# EAGLE design HHV_SCA_Demo-P1 (EAGLE 6.5.0)
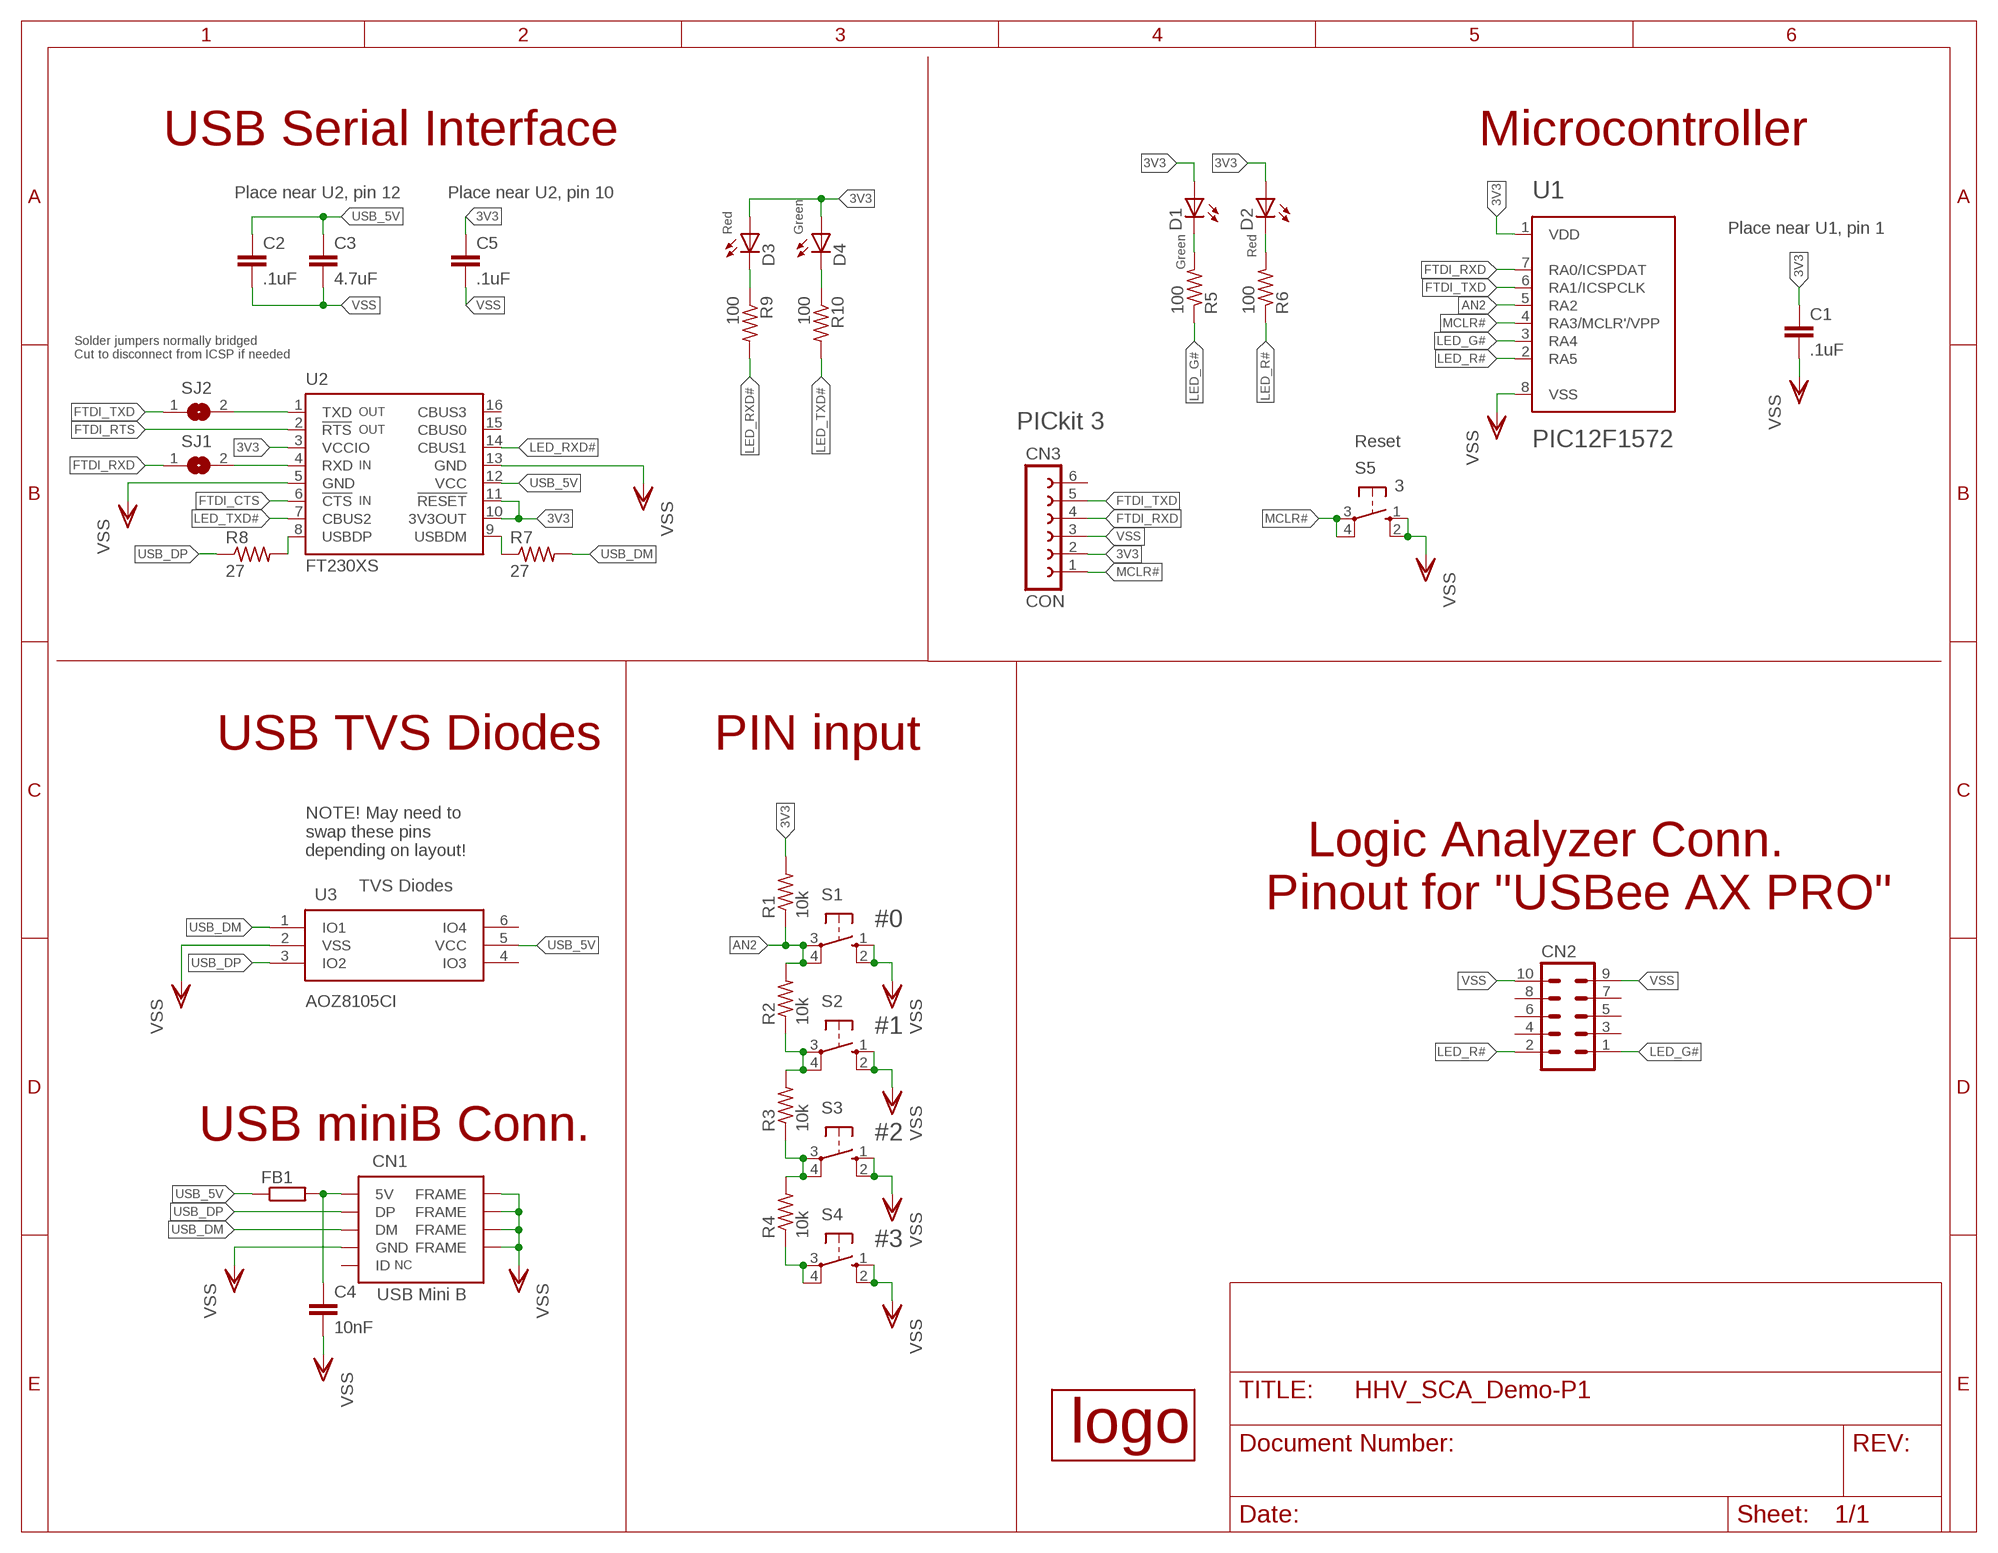
[diagram p0: schematic, sheet 1]
FRAME1 (FRAME_A_L): REV: P1

## Parts
C1  .1uF  C-EUC0603K  [C0603K]
C2  .1uF  C-EUC0603K  [C0603K]
C3  4.7uF  C-EUC0603K  [C0603K]
C4  10nF  C-EUC0603K  [C0603K]
C5  .1uF  C-EUC0603K  [C0603K]
CN1  MINIUSB-SMD  [MINIUSB-SMD]
CN2  MA05-2  [MA05-2]
CN3  CON  FE06-1  [FE06]
D1  LED3MM  [LED3MM]
D2  LED3MM  [LED3MM]
D3  LED3MM  [LED3MM]
D4  LED3MM  [LED3MM]
FB1  R-EU_R0603  [R0603]
R1  10k  R-US_R0603  [R0603]
R2  10k  R-US_R0603  [R0603]
R3  10k  R-US_R0603  [R0603]
R4  10k  R-US_R0603  [R0603]
R5  100  R-US_R0603  [R0603]
R6  100  R-US_R0603  [R0603]
R7  27  R-US_R0402  [R0402]
R8  27  R-US_R0402  [R0402]
R9  100  R-US_R0603  [R0603]
R10  100  R-US_R0603  [R0603]
S1  10-XX  [B3F-10XX]
S2  10-XX  [B3F-10XX]
S3  10-XX  [B3F-10XX]
S4  10-XX  [B3F-10XX]
S5  3  10-XX  [B3F-10XX]
SJ1  SJ  [SJ]
SJ2  SJ  [SJ]
U1  PIC12F1572  PIC12F1571  [DIL8]
U2  FT230XS  [SSOP16]
U3  AOZ8105CI  [SOT23-6L]
U$1  KBELOGO-SILK  [KBELOGO-SILK]

## Nets
3V3: C1.1 C5.1 CN3.2 D1.A D2.A D3.A D4.A R1.2 U1.1(VDD) U2.3(VCCIO) U2.10(3V3OUT) U2.11(!RESET)
AN2: R1.1 R2.2 S1.3(P) S1.4(P1) U1.5(RA2)
FTDI_CTS: U2.6(!CTS)
FTDI_RTS: U2.2(!RTS)
FTDI_RXD: CN3.4 SJ1.1 U1.7(RA0/ICSPDAT)
FTDI_TXD: CN3.5 SJ2.1 U1.6(RA1/ICSPCLK)
LED_G#: CN2.1 R5.1 U1.3(RA4)
LED_R#: CN2.2 R6.1 U1.2(RA5)
LED_RXD#: R9.2 U2.14(CBUS1)
LED_TXD#: R10.2 U2.7(CBUS2)
MCLR#: CN3.1 S5.3(P) S5.4(P1) U1.4(RA3/MCLR'/VPP)
N$1: R4.1 S4.3(P) S4.4(P1)
N$2: R3.1 R4.2 S3.3(P) S3.4(P1)
N$3: D2.K(C) R6.2
N$4: R7.1 U2.9(USBDM)
N$5: R2.1 R3.2 S2.3(P) S2.4(P1)
N$6: R8.2 U2.8(USBDP)
N$8: D1.K(C) R5.2
N$11: D3.K(C) R9.1
N$12: C4.1 CN1.5V FB1.2
N$13: D4.K(C) R10.1
N$14: SJ2.2 U2.1(TXD)
N$15: SJ1.2 U2.4(RXD)
USB_5V: C2.1 C3.1 FB1.1 U2.12(VCC) U3.5(VCC)
USB_DM: CN1.USB_DM(DM) R7.2 U3.1(IO1)
USB_DP: CN1.USB_DP(DP) R8.1 U3.3(IO2)
VSS: C1.2 C2.2 C3.2 C4.2 C5.2 CN1.GND@0(FRAME) CN1.GND@1(FRAME) CN1.GND@2(FRAME) CN1.GND@3(FRAME) CN1.VSS(GND) CN2.9 CN2.10 CN3.3 S1.1(S) S1.2(S1) S2.1(S) S2.2(S1) S3.1(S) S3.2(S1) S4.1(S) S4.2(S1) S5.1(S) S5.2(S1) U1.8(VSS) U2.5(GND) U2.13(GND) U3.2(VSS)
Unconnected: CN1.ID CN2.3 CN2.4 CN2.5 CN2.6 CN2.7 CN2.8 CN3.6 U2.15(CBUS0) U2.16(CBUS3) U3.4(IO3) U3.6(IO4)

## Notes on the sheet
- USB Serial Interface | Microcontroller
- Place near U2, pin 12 | Place near U2, pin 10
- Red | Green | Green | Red | Place near U1, pin 1
- Solder jumpers normally bridged
  Cut to disconnect from ICSP if needed
- OUT
- PICkit 3
- OUT
- Reset
- IN
- IN
- USB TVS Diodes | PIN input
- NOTE! May need to
  swap these pins
  depending on layout!
- TVS Diodes
- Logic Analyzer Conn.
  Pinout for "USBee AX PRO"
- #0
- #1
- USB miniB Conn. | #2
- CN1
- #3
- NC
- USB Mini B

## Library data of the parts
C1-C5 = rcl:C-EU: CAPACITOR, European symbol
CN1 = cuslibrary:MINIUSB-SMD: EDAC 690-005-299-043 CONN MINI USB RCPT RA TYPE B SMD
CN2 = con-lstb:MA05-2: PIN HEADER; OC_FARNELL: unknown; OC_NEWARK: unknown
CN3 = con-lsta:FE06-1: FEMALE HEADER; OC_FARNELL: unknown; OC_NEWARK: unknown
D1-D4 = led:LED: LED OSRAM: - CHIPLED LG R971, LG N971, LY N971, LG Q971, LY Q971, LO R971, LY R971 LH N974, LH R974 LS Q976, LO Q976, LY Q976 LO Q996 - Hyper CHIPLED LW Q18S LB Q993, LB Q99A, LB R99A - SideLED LS A670, LO A670, LY A670, LG A670, LP A670 LB A673, LV A673, LT A673, LW A673 LH A674 LY A675 LS A676, LA A676, LO A676, LY A676, LW A676 LS A679, LY A679, LG A679 - Hyper Micro SIDELED® LS Y876, LA Y876, LO Y876, LY Y876 LT Y87S - SmartLED LW L88C, LW L88S LB L89C, LB L89S, LG L890 LS L89K, LO L89K, LY L89K LS L896, LA L896, LO L896, LY L896 - TOPLED LS T670, LO T670, LY T670, LG T670, LP T670 LSG T670, LSP T670, LSY T670, LOP T670, LYG T670 LG T671, LOG T671, LSG T671 LB T673, LV T673, LT T673, LW T673 LH T674 LS T676, LA T676, LO T676, LY T676, LB T676, LH T676, LSB T676, LW T676 LB T67C, LV T67C, LT T67C, LS T67K, LO T67K, LY T67K, LW E67C LS E67B, LA E67B, LO E67B, LY E67B, LB E67C, LV E67C, LT E67C LW T67C LS T679, LY T679, LG T679 LS T770, LO T770, LY T770, LG T770, LP T770 LB T773, LV T773, LT T773, LW T773 LH T774 LS E675, LA E675, LY E675, LS T675 LS T776, LA T776, LO T776, LY T776, LB T776 LHGB T686 LT T68C, LB T68C - Hyper Mini TOPLED® LB M676 - Mini TOPLED Santana® LG M470 LS M47K, LO M47K, LY M47K Source: http://www.osram.convergy.de LUXEON: - LUMILED® LXK2-PW12-R00, LXK2-PW12-S00, LXK2-PW14-U00, LXK2-PW14-V00 LXK2-PM12-R00, LXK2-PM12-S00, LXK2-PM14-U00 LXK2-PE12-Q00, LXK2-PE12-R00, LXK2-PE12-S00, LXK2-PE14-T00, LXK2-PE14-U00 LXK2-PB12-K00, LXK2-PB12-L00, LXK2-PB12-M00, LXK2-PB14-N00, LXK2-PB14-P00, LXK2-PB14-Q00 LXK2-PR12-L00, LXK2-PR12-M00, LXK2-PR14-Q00, LXK2-PR14-R00 LXK2-PD12-Q00, LXK2-PD12-R00, LXK2-PD12-S00 LXK2-PH12-R00, LXK2-PH12-S00 LXK2-PL12-P00, LXK2-PL12-Q00, LXK2-PL12-R00 Source: www.luxeon.com KINGBRIGHT: KA-3528ASYC Source: www.kingbright.com
FB1 = rcl:R-EU_: RESISTOR, European symbol
R1-R10 = rcl:R-US_: RESISTOR, American symbol
S1-S5 = switch-omron:10-XX: OMRON SWITCH; MPN: B3F-1000; OC_FARNELL: 176432; OC_NEWARK: 36M3542
SJ1 SJ2 = jumper:SJ: SMD solder JUMPER
U1 = cuslibrary:PIC12F1571: PIC12F1571/2
U2 = ftdichip:FT230X: USB to BASIC UART IC Auto generated by make-symbol-device-package-bsdl.ulp Rev. 43 Source: Data sheet <http://www.ftdichip.com/Support/Documents/DataSheets/ICs/DS_FT230X.pdf>
U3 = cuslibrary:AOZ8105CI
U$1 = cuslibrary:KBELOGO-SILK

## Board
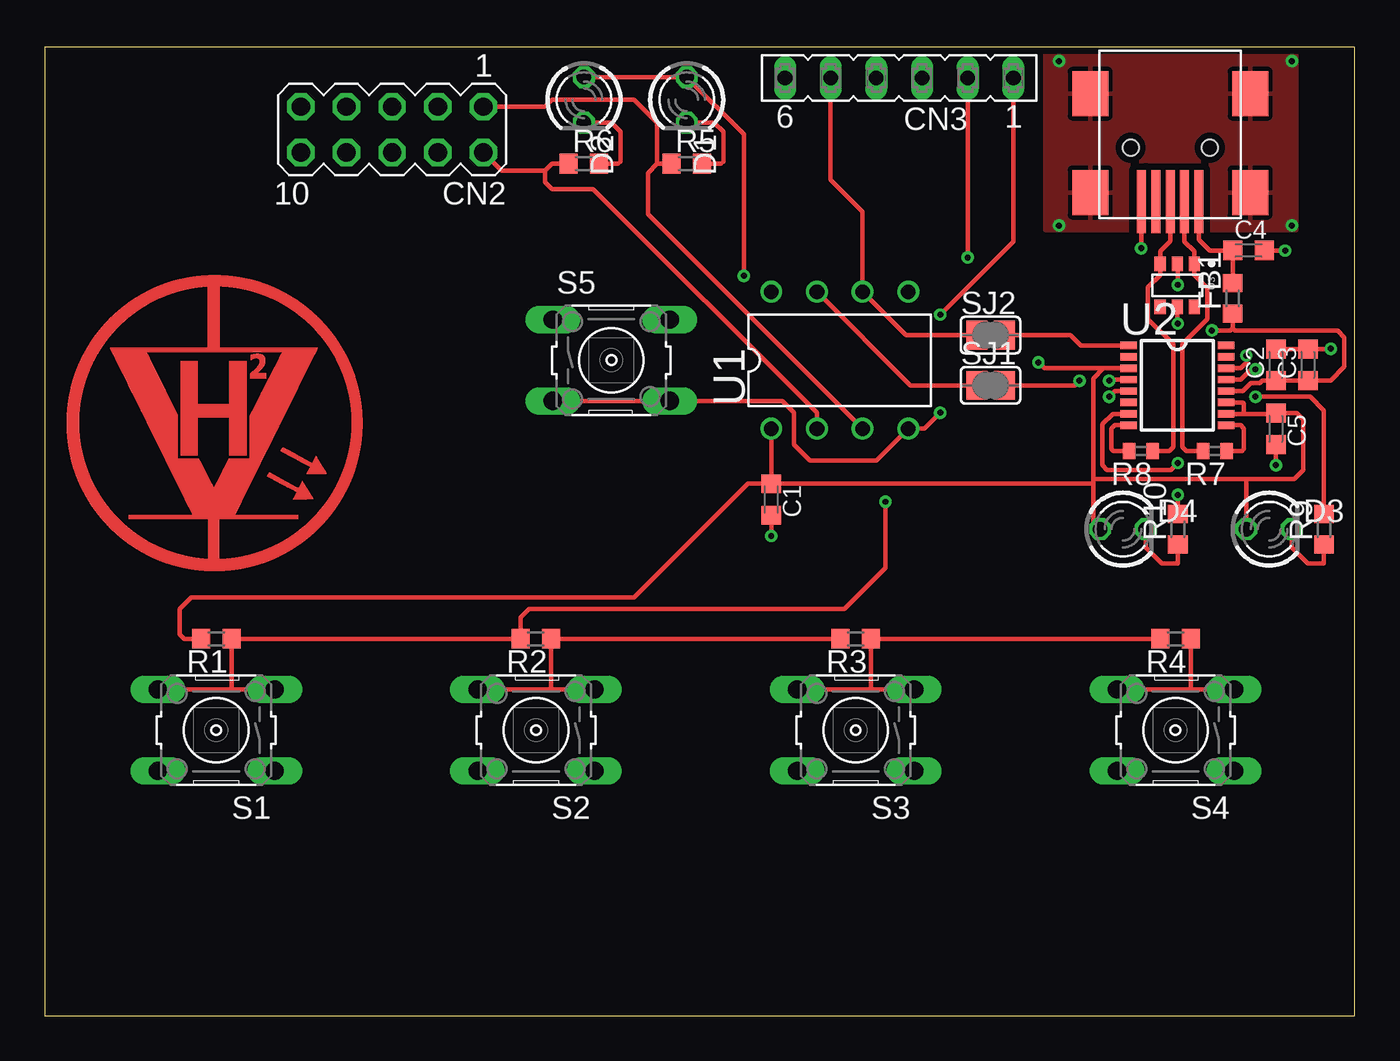
[diagram p1: board, top side]
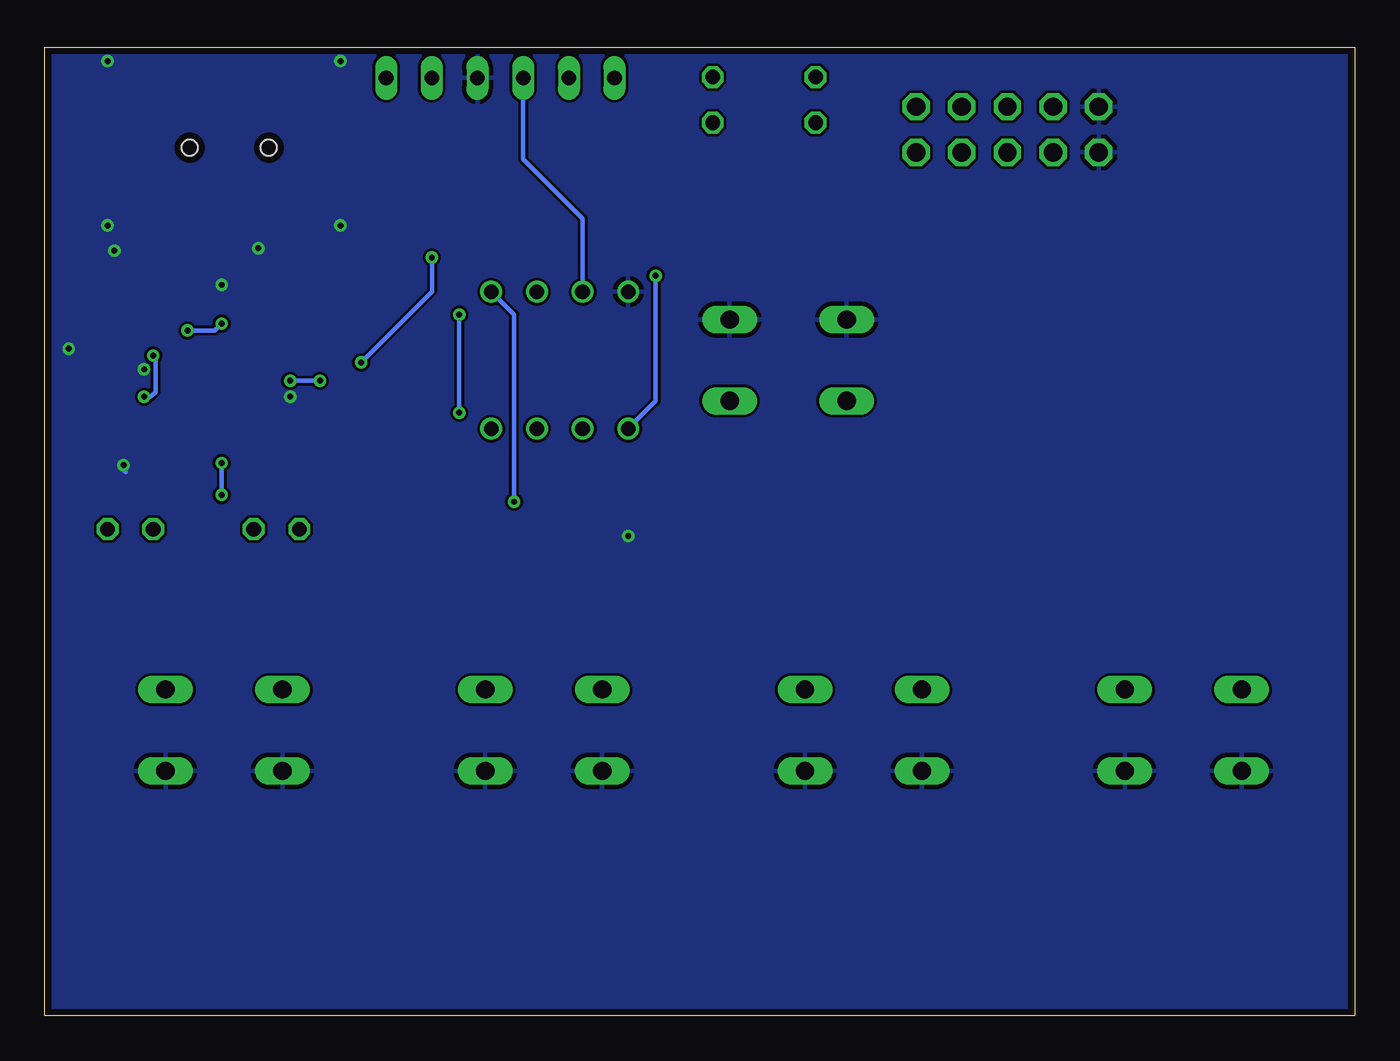
[diagram p2: board, bottom side, seen from below]

Size 72.82 x 53.85 mm. Coordinates in mm from the lower left corner, seen from the top.
Outline: 0,0 72.82,0 72.82,53.85 0,53.85 0,0
Copper layers (1*16): Top 0.0356mm / dielectric 1.5011mm / Bottom 0.0356mm
Design rules "OSHPark": minimum track width 6mil, minimum drill 13mil, track to track 6mil, track to pad 6mil, pad to pad 6mil, via to via 6mil, smd to smd 6mil, copper to edge 15mil, drill to drill 6mil, minimum pad ring 7mil, minimum via ring 7mil, stop-mask expansion 3mil, vias tented up to drill 13mil, thermal gap 10mil
tRestrict: area 60.7,43.6 to 61.2,47

### Footprints (pad centres in the part's own frame; a part is rotated, then mirrored left to right if it is on the bottom)
C0603K = smd 1.05 x 1.08: 1 -0.875,0; 2 0.875,0
MINIUSB-SMD = smd 0.5 x 3.5: 5V 0.6,2.99; ID 3,2.99; USB_DM 1.4,2.99; USB_DP 2.2,2.99; VSS 3.8,2.99 | smd 2 x 2.5: GND@0 -2.25,-3.01; GND@1 6.65,-3.01; GND@2 -2.25,2.49; GND@3 6.65,2.49 | hole 0.9: 0,0; 4.4,0
MA05-2 = drill 1.016 octagon: 1 -5.08,-1.27; 2 -5.08,1.27; 3 -2.54,-1.27; 4 -2.54,1.27; 5 0,-1.27; 6 0,1.27; 7 2.54,-1.27; 8 2.54,1.27; 9 5.08,-1.27; 10 5.08,1.27
FE06 = drill 0.813 long: 1 -6.35,0; 2 -3.81,0; 3 -1.27,0; 4 1.27,0; 5 3.81,0; 6 6.35,0
LED3MM = drill 0.813 octagon: A -1.27,0; K 1.27,0
R0603 = smd 1 x 1.1: 1 -0.85,0; 2 0.85,0
R0402 = smd 0.7 x 0.9: 1 -0.65,0; 2 0.65,0
B3F-10XX = drill 1.016 long: 1 -3.251,2.261; 2 3.251,2.261; 3 -3.251,-2.261; 4 3.251,-2.261
SJ = smd 1.168 x 1.6: 1 -0.762,0; 2 0.762,0
DIL8 = drill 0.813: 1 -3.81,-3.81; 2 -1.27,-3.81; 3 1.27,-3.81; 4 3.81,-3.81; 5 3.81,3.81; 6 1.27,3.81; 7 -1.27,3.81; 8 -3.81,3.81
SSOP16 = smd 0.914 x 0.406: 1 -2.718,2.223; 2 -2.718,1.587; 3 -2.718,0.953; 4 -2.718,0.318; 5 -2.718,-0.318; 6 -2.718,-0.953; 7 -2.718,-1.587; 8 -2.718,-2.223; 9 2.718,-2.223; 10 2.718,-1.587; 11 2.718,-0.953; 12 2.718,-0.318; 13 2.718,0.318; 14 2.718,0.953; 15 2.718,1.587; 16 2.718,2.223
SOT23-6L = smd 0.63 x 0.8: 1 -0.95,-1.2; 2 0,-1.2; 3 0.95,-1.2; 4 0.95,1.2; 5 0,1.2; 6 -0.95,1.2

### Placement (x,y rotation side)
C1  40.39,28.7 270 top
C2  68.45,36.2 90 top
C3  70.23,36.2 90 top
C4  66.93,42.55 0 top
C5  68.45,32.64 270 top
CN1  64.77,48.26 180 top
CN2  19.3,49.28 180 top
CN3  47.5,52.15 180 top
D1  35.69,50.93 270 top
D2  29.97,50.93 270 top
D3  68.07,27.05 0 top
D4  59.94,27.05 0 top
FB1  66.04,39.88 90 top
R1  9.53,20.95 180 top
R2  27.3,20.95 180 top
R3  45.09,20.95 180 top
R4  62.87,20.95 180 top
R5  35.69,47.37 0 top
R6  29.97,47.37 0 top
R7  65.05,31.39 180 top
R8  60.93,31.39 180 top
R9  71.12,27.05 90 top
R10  62.99,27.05 90 top
S1  9.53,15.88 180 top
S2  27.3,15.88 180 top
S3  45.09,15.88 180 top
S4  62.87,15.88 180 top
S5  31.5,36.45 0 top
SJ1  52.58,35.05 0 top
SJ2  52.58,37.85 0 top
U1  44.2,36.45 0 top
U2  62.97,35.05 0 top
U3  62.97,40.61 180 top
U$1  13.97,32 0 bottom

### Tracks (layer width: path | path; a pad name or v marks a point on that pad's centre or on a via)
3V3  (via drill 0.33)
  Top 0.254: U2.10 66.67,33.47 | 66.67,33.47 68.4,33.47 C5.1 69.61,33.51 69.98,33.15 69.98,30.35 69.47,29.84 66.8,29.84 | U2.11 66.61,34.1 66.67,34.04 66.67,33.47 | U2.3 58.86,36.01 | 58.86,36.01 58.29,35.43 58.29,29.84 | 58.29,29.84 58.29,29.59 | 58.29,29.59 58.29,27.43 D4.A | D3.A 66.8,29.84 | C1.1 U1.1 | C1.1 58.28,29.58 58.29,29.59 | 66.8,29.84 58.29,29.84 | D2.A D1.A 38.86,49.02 v38.86,41.15 | CN3.2 v51.31,42.17 v51.31,42.16 | v55.24,36.32 55.56,36.01 58.86,36.01 | C1.1 39.1,29.58 32.77,23.24 8.13,23.24 7.49,22.61 7.49,21.21 7.75,20.95 R1.2
  Bottom 0.254: v38.86,41.15 38.86,34.16 U1.1 | v51.31,42.16 51.31,40.26 v55.24,36.32
AN2  (via drill 0.33)
  Top 0.254: S1.3 10.38,18.14 | 10.38,18.14 S1.4 | 10.38,18.14 R1.1 R2.2 26.45,22.14 26.92,22.61 44.45,22.61 46.74,24.89 v46.74,28.57
  Bottom 0.254: v46.74,28.57 46.74,38.99 U1.5
FTDI_RXD
  Top 0.254: SJ1.1 48.13,35.05 U1.7
  Bottom 0.254: CN3.4 46.23,47.63 42.93,44.32 U1.7
FTDI_TXD
  Top 0.254: SJ2.1 47.88,37.85 U1.6 45.47,44.7 43.69,46.48 CN3.5
LED_G#
  Top 0.254: U1.3 33.53,44.58 33.53,46.86 34.04,47.37 | 34.04,47.37 R5.1 | CN2.1 27.81,50.55 28.19,50.93 32.77,50.93 34.04,49.66 34.04,47.37
LED_R#
  Top 0.254: U1.2 42.93,33.53 30.48,45.97 28.19,45.97 27.81,46.35 27.81,46.99 | 27.81,46.99 28.19,47.37 R6.1 | CN2.2 25.4,46.99 27.81,46.99
LED_RXD#  (via drill 0.33)
  Top 0.254: U2.14 66.48,36.01 66.8,36.32 v66.8,36.7 | R9.2 71.12,33.66 70.36,34.42 v67.31,34.42
  Bottom 0.254: v67.31,34.42 66.93,34.42 66.67,34.67 66.67,36.58 v66.8,36.7
LED_TXD#  (via drill 0.33)
  Top 0.254: U2.7 59.37,33.47 58.8,32.89 58.8,30.61 59.05,30.35 62.61,30.35 v62.99,30.73 | v62.99,28.96 R10.2
  Bottom 0.254: v62.99,30.73 v62.99,28.96
MCLR#  (via drill 0.33)
  Top 0.254: CN3.1 53.85,43.05 v49.78,38.99 | v49.78,33.53 48.9,32.64 U1.4 46.23,30.86 42.55,30.86 41.66,31.75 41.66,33.53 41.02,34.16 34.77,34.16 S5.4 S5.3
  Bottom 0.254: v49.78,38.99 v49.78,33.53
N$1
  Top 0.254: S4.3 63.75,18.14 63.72,18.14 | 63.72,18.14 S4.4 | R4.1 63.72,18.14
N$2
  Top 0.254: R4.2 R3.1 45.94,18.14 | S3.3 45.94,18.14 | S3.4 45.72,18.14 45.94,18.14
N$3
  Top 0.254: R6.2 31.88,47.37 32,47.5 32,49.15 31.5,49.66 D2.K
N$4
  Top 0.254: R7.1 66.57,31.39 66.67,31.5 66.67,32.64 66.48,32.83 U2.9
N$5
  Top 0.254: R3.2 R2.1 28.16,18.14 | S2.3 28.16,18.14 | S2.4 27.94,18.14 28.16,18.14
N$6
  Top 0.254: R8.2 59.41,31.39 59.31,31.5 59.31,32.64 59.5,32.83 U2.8
N$7
  Top 0.254: 52.96,37.85 52.2,37.85
N$8
  Top 0.254: R5.2 37.59,47.37 37.72,47.5 37.72,49.15 37.21,49.66 D1.K
N$9
  Top 0.254: 52.96,35.05 52.2,35.05
N$11
  Top 0.254: R9.1 71.12,25.15 70.23,25.15 69.34,26.04 D3.K
N$12
  Top 0.254: CN1.5V 64.17,43.15 64.77,42.55 C4.1 66.04,42.53 FB1.2
N$13
  Top 0.254: R10.1 62.99,25.15 62.1,25.15 61.21,26.04 D4.K
N$14
  Top 0.254: U2.1 57.59,37.27 57.02,37.85 SJ2.2
N$15  (via drill 0.33)
  Top 0.254: U2.4 59.24,35.37 v59.18,35.31 | v57.53,35.31 57.28,35.05 SJ1.2
  Bottom 0.254: v59.18,35.31 v57.53,35.31
USB_5V  (via drill 0.33)
  Top 0.254: U2.12 66.61,34.73 67.06,35.18 67.56,35.18 67.69,35.31 68.44,35.31 C2.1 C3.1 71.49,35.32 72.26,36.1 72.26,37.72 71.88,38.1 66.17,38.1 66.04,38.23 | FB1.1 66.04,38.23 | U3.5 62.97,38.51 v62.99,38.48 | v64.9,38.1 65.91,38.1 66.04,38.23
  Bottom 0.254: v62.99,38.48 63.37,38.1 v64.9,38.1
USB_DM
  Top 0.254: CN1.USB_DM 63.37,43.06 63.92,42.51 U3.1 63.92,41.19 64.64,40.46 64.64,38.73 63.25,37.34 63.25,31.62 63.48,31.39 R7.2
USB_DP
  Top 0.254: CN1.USB_DP 62.57,43.06 62.02,42.51 U3.3 62.02,41.19 61.34,40.51 61.34,38.73 62.74,37.34 62.74,31.62 62.51,31.39 R8.1
VSS  (via drill 0.33)
  Top 0.254: C5.2 v68.45,30.61 | U2.13 66.48,35.37 67.06,35.94 v67.31,35.94 | U3.2 62.99,41.79 v62.99,40.64 | C4.2 v68.96,42.55 | C2.2 C3.2 71.49,37.07 v71.5,37.08 | U2.5 59.5,34.73 v59.18,34.42 | CN1.VSS 60.97,42.68 v60.96,42.67 | C1.2 v40.39,26.67
  Bottom 0.254: 68.45,30.35 68.33,30.23
  other vias: 56.39,53.09 69.34,53.09 69.34,43.94 56.39,43.94
  pour Bottom: 0,53.85 72.77,53.85 72.77,0 0,0
  pour Top (isolate 0.381): 55.63,53.85 69.6,53.85 69.6,43.69 55.63,43.69
(copper drawn outside any net)
  shapes: Top area x5059

### Text on the board
tNames: www.KBEmbedded.com
tTest: CN2 | 1 | D2 | D1 | CN1 | CN3 | R6 | R5 | USBee AX PRO | Red | Green | C4 | U3 | Cut when ICSP / Short for operation | FB1 | SW5 | C2 | C3 | U2 | C5 | Reset | U1 | R8 | R7 | TX | RX | C1 | R9 | D4 | R10 | D3 | R1 | R2 | R3 | R4 | SW1 | SW2 | SW3 | SW4 | 0 | 1 | 2 | 3 | DEF CON HHV Side Channel Timing Attack Demo
bTest: www.KBEmbedded.com | HHV SCA Rev P1 | Connect USB to host / Connect USB AX PRO Analyzer / Open USB serial terminal on host / Follow on-screen instructions